# Altium schematic sheet level_converter.SchDoc
size A; SheetNumber: 1; SheetTotal: 1
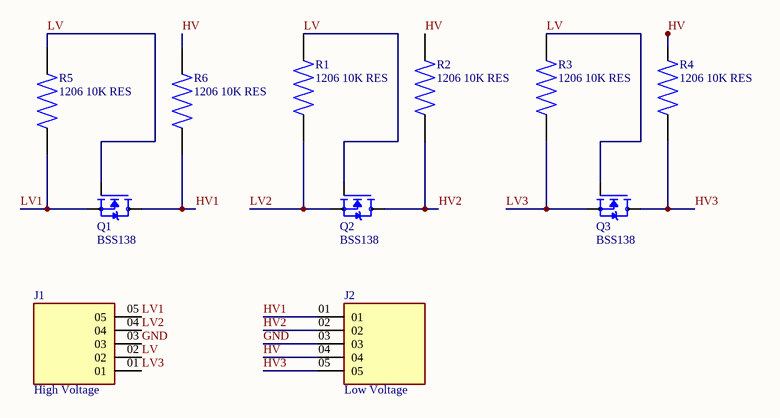
[diagram p0: level_converter.SchDoc]

## Parts
J1  High Voltage  [SAMTEC_MTSW-105-22-S-S-260]
J2  Low Voltage  [SAMTEC_MTSW-105-22-S-S-260]
Q1  BSS138  [SOT95P240X111-3N]
Q2  BSS138  [SOT95P240X111-3N]
Q3  BSS138  [SOT95P240X111-3N]
R1  1206 10K RES  [RES_ERA8ARW103V]
R2  1206 10K RES  [RES_ERA8ARW103V]
R3  1206 10K RES  [RES_ERA8ARW103V]
R4  1206 10K RES  [RES_ERA8ARW103V]
R5  1206 10K RES  [RES_ERA8ARW103V]
R6  1206 10K RES  [RES_ERA8ARW103V]

## Nets
GND: J1.03 J2.03
HV: J2.04 R2.2 R4.2 R6.2
HV1: J2.01 Q1.3(D) R6.1
HV2: J2.02 Q2.3(D) R2.1
HV3: J2.05 Q3.3(D) R4.1
LV: J1.02 Q1.1(G) Q2.1(G) Q3.1(G) R1.2 R3.2 R5.2
LV1: J1.05 Q1.2(S) R5.1
LV2: J1.04 Q2.2(S) R1.1
LV3: J1.01 Q3.2(S) R3.1

## Library data of the parts
J1 J2 = MTSW-105-22-S-S-260: MP: MTSW-105-22-S-S-260; Price: None; Availability: Unavailable; Package: None; Value: *
Q1-Q3 = BSS138: N-Channel 50V 220mA (Ta) 360mW (Ta) Surface Mount SOT-23-3; MF: ON Semiconductor; MP: BSS138; Price: None; SnapEDA_Link: https://www.snapeda.com/parts/BSS138/ON%20Semiconductor/view-part/4794929/?ref=snap; Availability: Good; Purchase-URL: https://pricing.snapeda.com/search/part/BSS138/?ref=eda; Value: *; Check_prices: https://www.snapeda.com/parts/BSS138/ON%20Semiconductor/view-part/4794929/?ref=eda; Package: SOT-23 ON Semiconductor
R1-R6 = ERA8ARW103V: MP: ERA8ARW103V; Availability: Unavailable; Package: None; Price: None
  R1-R4: Value: *
  R5 R6: Value: 10k